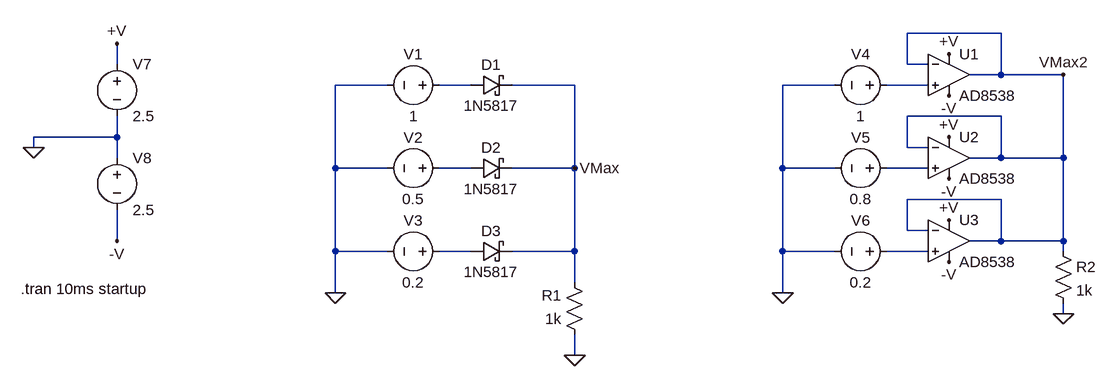
[diagram p0: schematic V2.asc]
V2.asc, the LTspice schematic file:
Version 4
SHEET 1 1608 680
WIRE 1088 -192 944 -192
WIRE -272 -144 -272 -176
WIRE 944 -144 944 -192
WIRE 976 -144 944 -144
WIRE 1088 -128 1088 -192
WIRE 1088 -128 1040 -128
WIRE 1184 -128 1088 -128
WIRE 144 -112 64 -112
WIRE 272 -112 224 -112
WIRE 432 -112 336 -112
WIRE 832 -112 752 -112
WIRE 976 -112 912 -112
WIRE 1088 -64 944 -64
WIRE -272 -32 -272 -64
WIRE -272 -32 -400 -32
WIRE -400 -16 -400 -32
WIRE 944 -16 944 -64
WIRE 976 -16 944 -16
WIRE -272 0 -272 -32
WIRE 1088 0 1088 -64
WIRE 1088 0 1040 0
WIRE 1184 0 1184 -128
WIRE 1184 0 1088 0
WIRE 64 16 64 -112
WIRE 144 16 64 16
WIRE 272 16 224 16
WIRE 432 16 432 -112
WIRE 432 16 336 16
WIRE 752 16 752 -112
WIRE 832 16 752 16
WIRE 976 16 912 16
WIRE 1088 64 944 64
WIRE 944 112 944 64
WIRE 976 112 944 112
WIRE -272 128 -272 80
WIRE 1088 128 1088 64
WIRE 1088 128 1040 128
WIRE 1184 128 1184 0
WIRE 1184 128 1088 128
WIRE 64 144 64 16
WIRE 144 144 64 144
WIRE 272 144 224 144
WIRE 432 144 432 16
WIRE 432 144 336 144
WIRE 752 144 752 16
WIRE 832 144 752 144
WIRE 976 144 912 144
WIRE 1184 144 1184 128
WIRE 432 192 432 144
WIRE 64 208 64 144
WIRE 752 208 752 144
WIRE 1184 240 1184 224
WIRE 432 304 432 272
FLAG 64 208 0
FLAG 432 304 0
FLAG 432 16 VMax
FLAG 752 208 0
FLAG -400 -16 0
FLAG -272 -176 +V
FLAG -272 128 -V
FLAG 1008 -160 +V
FLAG 1008 -96 -V
FLAG 1008 -32 +V
FLAG 1008 32 -V
FLAG 1008 96 +V
FLAG 1008 160 -V
FLAG 1184 240 0
FLAG 1184 -128 VMax2
SYMBOL voltage 240 -112 R90
WINDOW 0 -32 56 VBottom 2
WINDOW 3 32 56 VTop 2
WINDOW 123 0 0 Left 0
WINDOW 39 0 0 Left 0
SYMATTR InstName V1
SYMATTR Value 1
SYMBOL voltage 240 16 R90
WINDOW 0 -32 56 VBottom 2
WINDOW 3 32 56 VTop 2
WINDOW 123 0 0 Left 0
WINDOW 39 0 0 Left 0
SYMATTR InstName V2
SYMATTR Value 0.5
SYMBOL voltage 240 144 R90
WINDOW 0 -32 56 VBottom 2
WINDOW 3 32 56 VTop 2
WINDOW 123 0 0 Left 0
WINDOW 39 0 0 Left 0
SYMATTR InstName V3
SYMATTR Value 0.2
SYMBOL schottky 272 -96 R270
WINDOW 0 32 32 VTop 2
WINDOW 3 0 32 VBottom 2
SYMATTR InstName D1
SYMATTR Value 1N5817
SYMATTR Description Diode
SYMATTR Type diode
SYMBOL schottky 272 32 R270
WINDOW 0 32 32 VTop 2
WINDOW 3 0 32 VBottom 2
SYMATTR InstName D2
SYMATTR Value 1N5817
SYMATTR Description Diode
SYMATTR Type diode
SYMBOL schottky 272 160 R270
WINDOW 0 32 32 VTop 2
WINDOW 3 0 32 VBottom 2
SYMATTR InstName D3
SYMATTR Value 1N5817
SYMATTR Description Diode
SYMATTR Type diode
SYMBOL res 448 288 R180
WINDOW 0 36 76 Left 2
WINDOW 3 36 40 Left 2
SYMATTR InstName R1
SYMATTR Value 1k
SYMBOL voltage 928 -112 R90
WINDOW 0 -32 56 VBottom 2
WINDOW 3 32 56 VTop 2
WINDOW 123 0 0 Left 0
WINDOW 39 0 0 Left 0
SYMATTR InstName V4
SYMATTR Value 1
SYMBOL voltage 928 16 R90
WINDOW 0 -32 56 VBottom 2
WINDOW 3 32 56 VTop 2
WINDOW 123 0 0 Left 0
WINDOW 39 0 0 Left 0
SYMATTR InstName V5
SYMATTR Value 0.8
SYMBOL voltage 928 144 R90
WINDOW 0 -32 56 VBottom 2
WINDOW 3 32 56 VTop 2
WINDOW 123 0 0 Left 0
WINDOW 39 0 0 Left 0
SYMATTR InstName V6
SYMATTR Value 0.2
SYMBOL voltage -272 -160 R0
WINDOW 123 0 0 Left 0
WINDOW 39 0 0 Left 0
SYMATTR InstName V7
SYMATTR Value 2.5
SYMBOL voltage -272 -16 R0
WINDOW 123 0 0 Left 0
WINDOW 39 0 0 Left 0
SYMATTR InstName V8
SYMATTR Value 2.5
SYMBOL OpAmps\\AD8538 1008 -192 R0
SYMATTR InstName U1
SYMBOL OpAmps\\AD8538 1008 -64 R0
SYMATTR InstName U2
SYMBOL OpAmps\\AD8538 1008 64 R0
SYMATTR InstName U3
SYMBOL res 1168 128 R0
SYMATTR InstName R2
SYMATTR Value 1k
TEXT -420 202 Left 2 !.tran 10ms startup

The netlist it stands for:
* V2.asc
V1 N001 0 1
V2 N003 0 0.5
V3 N005 0 0.2
D1 N001 VMax 1N5817
D2 N003 VMax 1N5817
D3 N005 VMax 1N5817
R1 0 VMax 1k
V4 N002 0 1
V5 N004 0 0.8
V6 N006 0 0.2
V7 +V 0 2.5
V8 0 -V 2.5
XU1 N002 VMax2 +V -V VMax2 AD8538  ; pins In+ In- V+ V- OUT
XU2 N004 VMax2 +V -V VMax2 AD8538  ; pins In+ In- V+ V- OUT
XU3 N006 VMax2 +V -V VMax2 AD8538  ; pins In+ In- V+ V- OUT
R2 VMax2 0 1k
.model D D
.lib standard.dio
.tran 10ms startup
.backanno
.end